# EAGLE design led_driver_iw339_v1 (EAGLE 9.2.2)
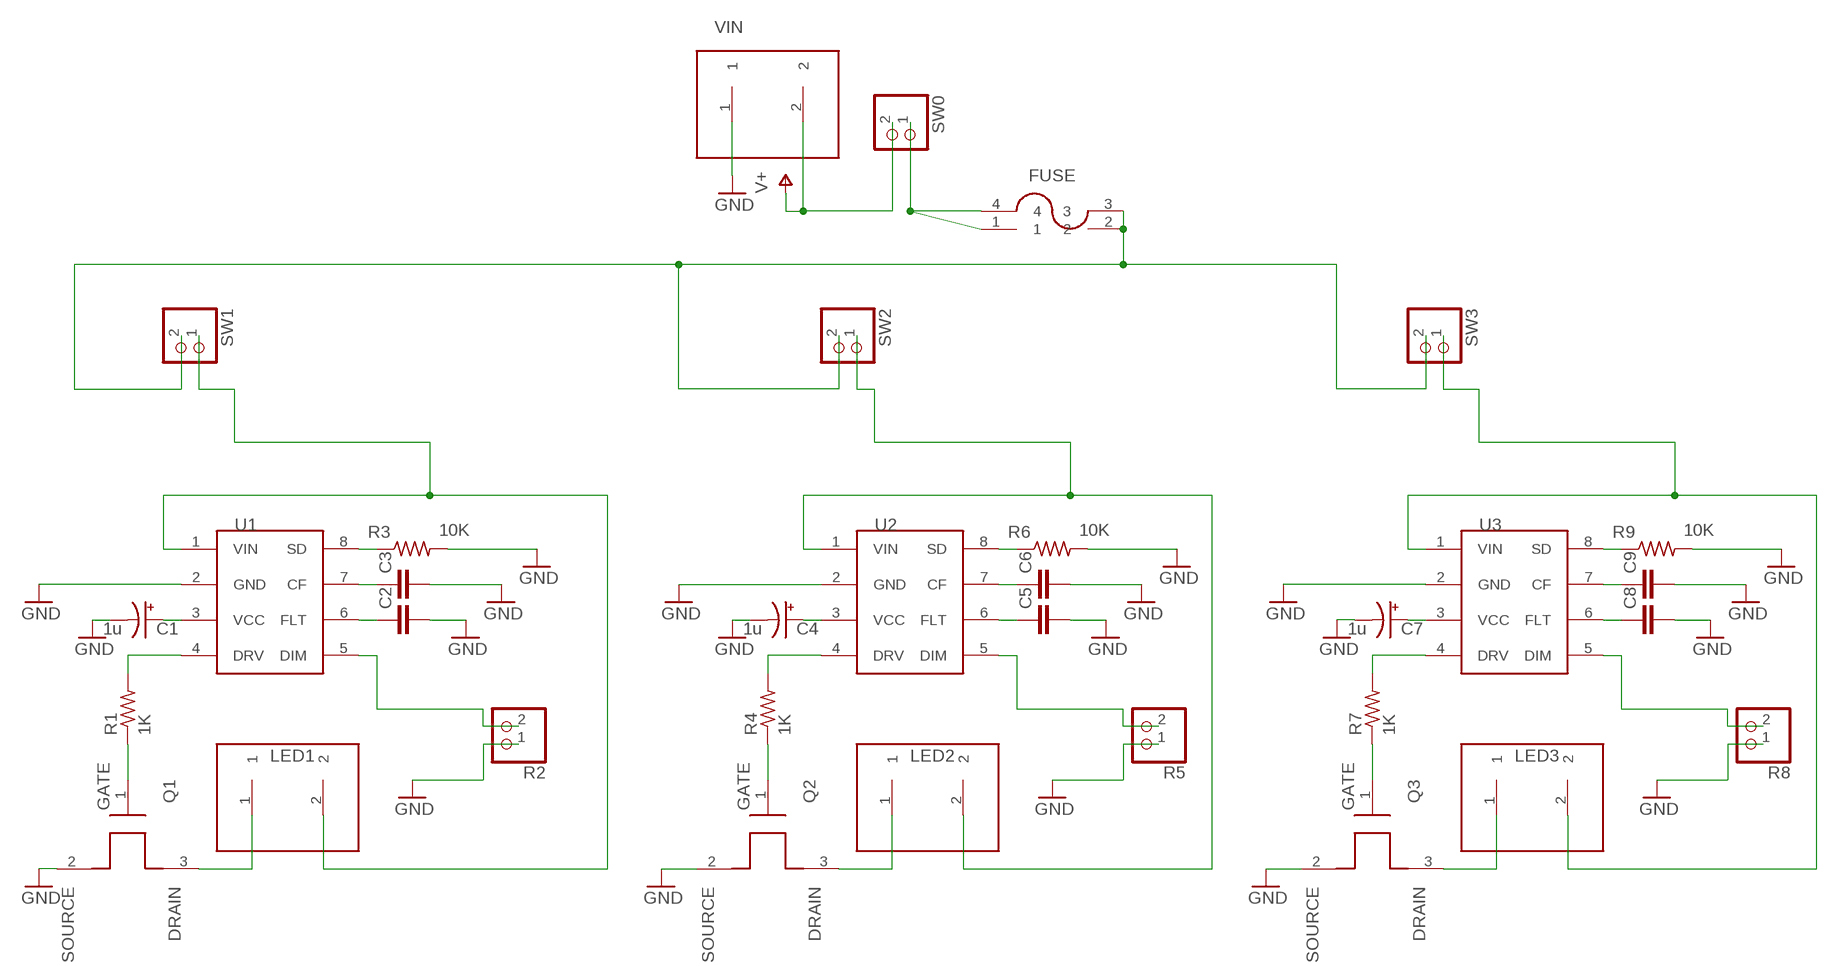
[diagram p0: schematic, sheet 1]

## Parts
C1  1u  CPOL-USE2-5  [E2-5]
C2  0.1u  THD_CAP  [C050-025X075]
C3  1n  THD_CAP  [C050-025X075]
C4  1u  CPOL-USE2-5  [E2-5]
C5  0.1u  THD_CAP  [C050-025X075]
C6  1n  THD_CAP  [C050-025X075]
C7  1u  CPOL-USE2-5  [E2-5]
C8  0.1u  THD_CAP  [C050-025X075]
C9  1n  THD_CAP  [C050-025X075]
FUSE  5X20_FUSE_HOLDER  [5X20_FUSE_HOLDER]
LED1  TERMINAL_BLOCK  [TERMINAL_BLOCK]
LED2  TERMINAL_BLOCK  [TERMINAL_BLOCK]
LED3  TERMINAL_BLOCK  [TERMINAL_BLOCK]
Q1  DMTH6016LK3  [TO252]
Q2  DMTH6016LK3  [TO252]
Q3  DMTH6016LK3  [TO252]
R1  1K  R-US_0207/10  [0207/10]
R2  PINHD-1X2  [1X02]
R3  10K  R-US_0207/10  [0207/10]
R4  1K  R-US_0207/10  [0207/10]
R5  PINHD-1X2  [1X02]
R6  10K  R-US_0207/10  [0207/10]
R7  1K  R-US_0207/10  [0207/10]
R8  PINHD-1X2  [1X02]
R9  10K  R-US_0207/10  [0207/10]
SW0  PINHD-1X2  [1X02]
SW1  PINHD-1X2  [1X02]
SW2  PINHD-1X2  [1X02]
SW3  PINHD-1X2  [1X02]
U1  IW339"  [SOIC-8]
U2  IW339"  [SOIC-8]
U3  IW339"  [SOIC-8]
VIN  TERMINAL_BLOCK  [TERMINAL_BLOCK]

## Nets
CF1: C3.1 U1.7(CF)
CF2: C6.1 U2.7(CF)
CF3: C9.1 U3.7(CF)
DIM1: R2.2 U1.5(DIM)
DIM2: R5.2 U2.5(DIM)
DIM3: R8.2 U3.5(DIM)
DRAIN1: LED1.1 Q1.3(DRAIN)
DRAIN2: LED2.1 Q2.3(DRAIN)
DRAIN3: LED3.1 Q3.3(DRAIN)
DRV1: R1.2 U1.4(DRV)
DRV2: R4.2 U2.4(DRV)
DRV3: R7.2 U3.4(DRV)
FLT1: C2.1 U1.6(FLT)
FLT2: C5.1 U2.6(FLT)
FLT3: C8.1 U3.6(FLT)
GATE1: Q1.1(GATE) R1.1
GATE2: Q2.1(GATE) R4.1
GATE3: Q3.1(GATE) R7.1
GND: C1.- C2.2 C3.2 C4.- C5.2 C6.2 C7.- C8.2 C9.2 Q1.2(SOURCE) Q2.2(SOURCE) Q3.2(SOURCE) R2.1 R3.2 R5.1 R6.2 R8.1 R9.2 U1.2(GND) U2.2(GND) U3.2(GND) VIN.1
SD1: R3.1 U1.8(SD)
SD2: R6.1 U2.8(SD)
SD3: R9.1 U3.8(SD)
SW0OUT: FUSE.1 FUSE.4 SW0.1
VCC1: C1.+ U1.3(VCC)
VCC2: C4.+ U2.3(VCC)
VCC3: C7.+ U3.3(VCC)
VIN: SW0.2 VIN.2 ; supply symbol labelled V+
VIN0: FUSE.2 FUSE.3 SW1.2 SW2.2 SW3.2
VIN1: LED1.2 SW1.1 U1.1(VIN)
VIN2: LED2.2 SW2.1 U2.1(VIN)
VIN3: LED3.2 SW3.1 U3.1(VIN)

## Library data of the parts
C1 C4 C7 = rcl:CPOL-US: POLARIZED CAPACITOR, American symbol; SPICEPREFIX: C
C2 C3 C5 C6 C8 C9 = MyLib:THD_CAP
FUSE = MyLib:5X20_FUSE_HOLDER
LED1-LED3 VIN = MyLib:TERMINAL_BLOCK
Q1-Q3 = MyLib:DMTH6016LK3
R1 R3 R4 R6 R7 R9 = rcl:R-US_: RESISTOR, American symbol; SPICEPREFIX: R
R2 R5 R8 SW0 SW1-SW3 = pinhead:PINHD-1X2: PIN HEADER
U1-U3 = MyLib:IW339

## Net classes
0 default: clearance 0.205 mm

## Board
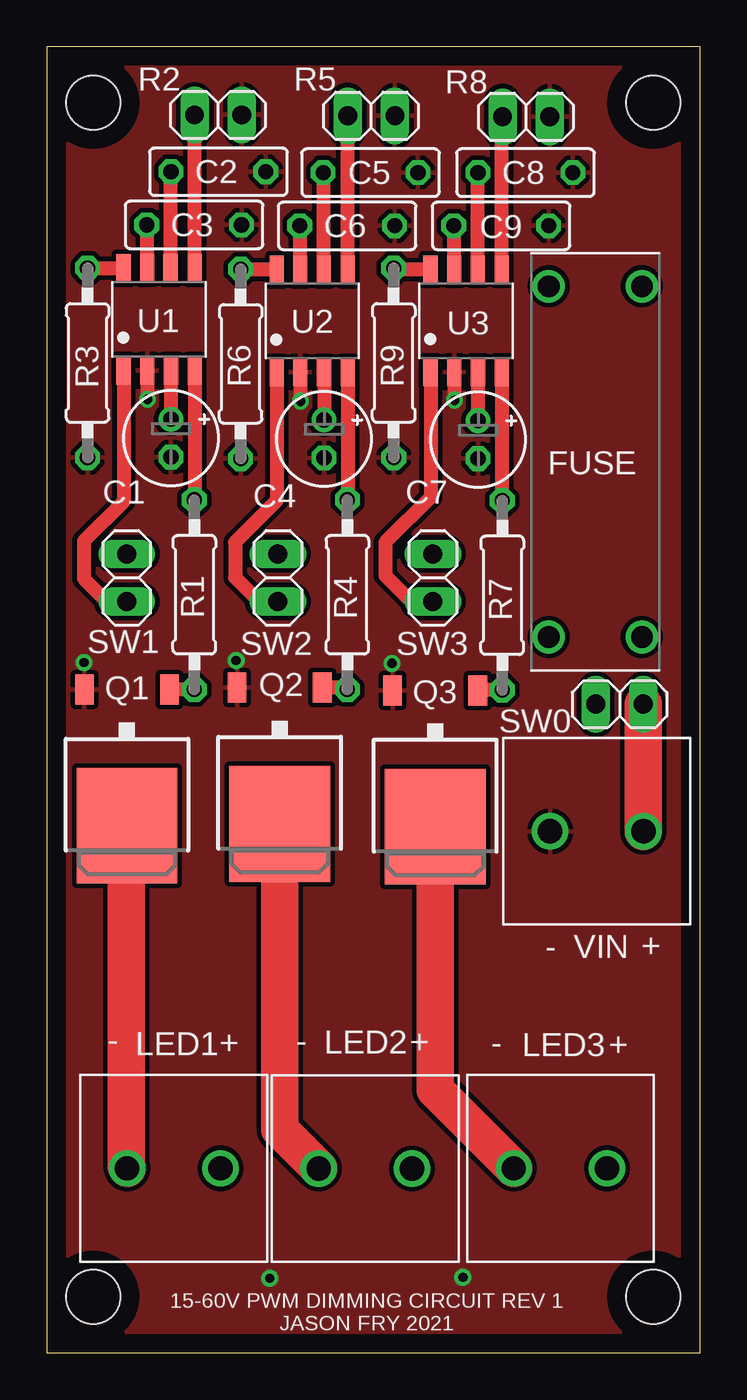
[diagram p1: board, top side]
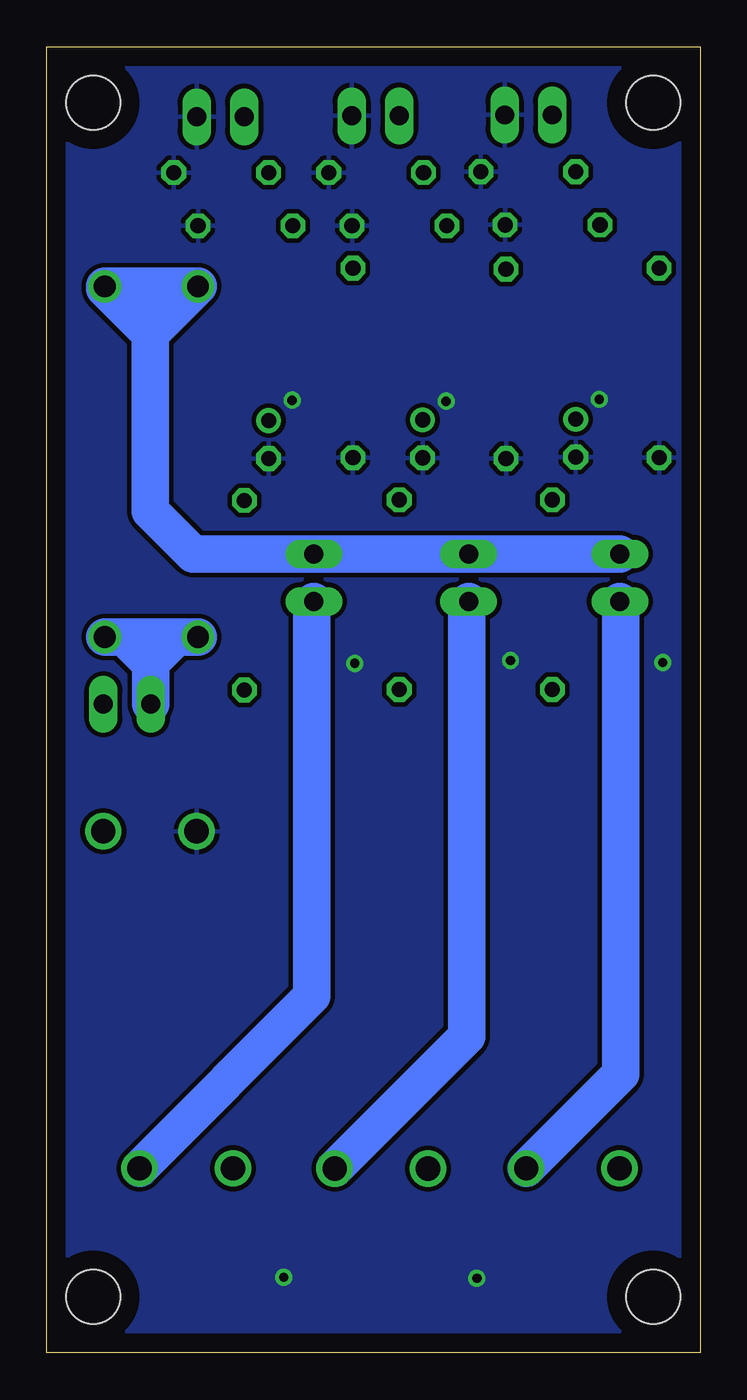
[diagram p2: board, bottom side, seen from below]

Size 35 x 70 mm. Coordinates in mm from the lower left corner, seen from the top.
Outline: 0,70 0,0 35,0 35,70 0,70
Copper layers (1*16): Top 0.035mm / dielectric 1.5mm / Bottom 0.035mm
Design rules "default": minimum track width 6mil, minimum drill 0.35mm, track to track 6mil, track to pad 6mil, pad to pad 6mil, via to via 6mil, smd to smd 6mil, copper to edge 40mil, drill to drill 6mil, minimum pad ring 10mil, minimum via ring 8mil, stop-mask expansion 4mil, vias tented up to drill 0mil, thermal gap 10mil
Holes 2.9 mm at 2.5,67 2.5,3 32.5,3 32.5,67

### Footprints (pad centres in the part's own frame; a part is rotated, then mirrored left to right if it is on the bottom)
E2-5 = drill 0.813 pad 1.27: + -1.016,0 | drill 0.813 pad 1.27 octagon: - 1.016,0
C050-025X075 = drill 0.813 octagon: 1 -2.54,0; 2 2.54,0
5X20_FUSE_HOLDER = drill 1.17: 1 0,0; 2 18.796,0; 3 18.796,5; 4 0,5
TERMINAL_BLOCK = drill 1.3: 1 0,0; 2 0,5
TO252 = smd 1 x 1.6: 1 -2.28,-4.8; 2 2.28,-4.8 | smd 5.4 x 6.2: 3 0,2.5
0207/10 = drill 0.813 octagon: 1 -5.08,0; 2 5.08,0
1X02 = drill 1.016 long: 1 -1.27,0; 2 1.27,0
SOIC-8 = smd 0.76 x 1.52: 1 0,0; 2 1.27,0; 3 2.54,0; 4 3.81,0; 5 3.81,5.48; 6 2.52,5.48; 7 1.27,5.48; 8 0,5.48

### Placement (x,y rotation side)
C1  6.66,49.02 270 top
C2  9.2,63.3 0 top
C3  7.9,60.45 0 top
C4  14.86,48.98 270 top
C5  17.35,63.25 0 top
C6  16.1,60.4 0 top
C7  23.11,48.94 270 top
C8  25.65,63.25 0 top
C9  24.35,60.4 0 top
FUSE  31.89,38.36 90 top
LED1  4.31,9.89 270 top
LED2  14.57,9.88 270 top
LED3  25.02,9.89 270 top
Q1  4.3,30.75 180 top
Q2  12.48,30.85 180 top
Q3  20.81,30.7 180 top
R1  7.91,40.63 90 top
R2  9.19,66.34 180 top
R3  2.19,53.05 270 top
R4  16.11,40.63 90 top
R5  17.39,66.29 180 top
R6  10.39,53 270 top
R7  24.41,40.6 90 top
R8  25.69,66.24 180 top
R9  18.59,53.05 270 top
SW0  30.69,34.76 0 top
SW1  4.29,41.54 90 top
SW2  12.39,41.54 90 top
SW3  20.69,41.54 90 top
U1  4.12,52.64 0 top
U2  12.32,52.56 0 top
U3  20.57,52.57 0 top
VIN  26.97,27.95 270 top

### Tracks (layer width: path | path; a pad name or v marks a point on that pad's centre or on a via)
CF1
  Top 0.76: U1.7 5.39,60.42 C3.1
CF2
  Top 0.76: U2.7 13.59,60.37 C6.1
CF3
  Top 0.5: 21.81,58.08 U3.7
  Top 0.76: U3.7 21.84,60.37 C9.1
DIM1
  Top 0.76: U1.5 R2.2
DIM2
  Top 0.76: U2.5 16.13,66.28 R5.2
DIM3
  Top 0.76: U3.5 24.38,66.2 R8.2
DRAIN1
  Top 2: LED1.1 4.31,9.94 4.26,9.99 4.26,28.21 Q1.3
DRAIN2
  Top 2: LED2.1 12.48,11.97 Q2.3
DRAIN3
  Top 2: LED3.1 20.81,14.1 Q3.3
DRV1
  Top 0.76: U1.4 7.93,45.73 R1.2
DRV2
  Top 0.76: R4.2 16.13,45.73 U2.4
DRV3
  Top 0.76: U3.4 24.38,45.71 R7.2
FLT1
  Top 0.76: U1.6 6.64,63.28 C2.1
FLT2
  Top 0.5: U2.6 14.86,58.06
  Top 0.76: U2.6 14.84,63.22 C5.1
FLT3
  Top 0.76: U3.6 23.09,63.23 C8.1
GATE1
  Top 0.75: R1.1 Q1.1
GATE2
  Top 0.75: R4.1 16.01,35.65 Q2.1
GATE3
  Top 0.75: R7.1 23.11,35.52 Q3.1
GND  (via drill 0.5)
  Top 0.76: U1.2 5.39,51.11 v5.4,51.1 | U2.2 v13.59,51.01 v13.6,51 | U3.2 21.84,51.06 v21.85,51.05
  other vias: 2,37 10.15,37.1 18.5,36.95 11.95,4 22.3,4.05
  pour Top (isolate 0.25): 0,70 0,0 35,0 35,70
  pour Bottom (isolate 0.25): 0,70 0,0 35,0 35,70
SD1
  Top 0.5: 4.11,58.13 U1.8
  Top 0.76: R3.1 4.11,58.13
SD2
  Top 0.5: 12.28,58.08 U2.8
  Top 0.76: U2.8 10.43,58.04 R6.1
SD3
  Top 0.5: 20.49,58.13 U3.8
  Top 0.76: U3.8 18.67,58.05 R9.1
SW0OUT
  Bottom 2: SW0.1 29.42,36.92 29.45,36.95 | 29.45,36.95 28.04,38.36 FUSE.4 FUSE.1 30.86,38.36 29.45,36.95
VCC1
  Top 0.76: U1.3 C1.+
VCC2
  Top 0.76: U2.3 C4.+
VCC3
  Top 0.5: U3.3
  Top 0.76: U3.3 C7.+
VIN
  Top 2: VIN.2 SW0.2
VIN0
  Bottom 2: SW1.2 SW2.2 SW3.2 27.16,42.81 29.45,45.1 29.45,54.6 | 29.45,54.6 29.45,55.25 | 29.45,54.6 FUSE.3 29.45,57.16 FUSE.2 31.89,57.04 29.45,54.6 | 29.45,54.6 | 29.45,54.6
VIN1
  Top 0.5: U1.1
  Top 0.76: U1.1 4.12,45.62 2,43.5 2,41.5 3.23,40.27 SW1.1
  Bottom 2: SW1.1 4.24,40.22 4.24,14.96 LED1.2
VIN2
  Top 0.5: 12.31,52.55 U2.1
  Top 0.76: U2.1 12.32,45.67 10.1,43.45 10.1,41.55 11.38,40.27 SW2.1
  Bottom 2: SW2.1 12.49,40.17 12.49,16.96 LED2.2
VIN3
  Top 0.5: 20.66,52.48 U3.1
  Top 0.76: U3.1 20.57,45.87 18.15,43.45 18.15,41.65 19.53,40.27 SW3.1
  Bottom 2: SW3.1 20.79,40.17 20.79,19.12 LED3.2

### Text on the board
tNames: Q3 | - | + | - | + | - | + | - | + | 15-60V PWM DIMMING CIRCUIT REV 1 / JASON FRY 2021